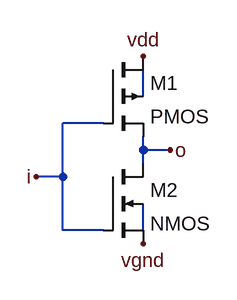
[diagram p0: schematic CMOS_Inverter.asc]
CMOS_Inverter.asc, the LTspice schematic file:
Version 4.1
SHEET 1 880 680
WIRE 256 112 256 80
WIRE 208 144 160 144
WIRE 256 176 256 160
WIRE 288 176 256 176
WIRE 256 192 256 176
WIRE 160 208 160 144
WIRE 160 208 128 208
WIRE 160 272 160 208
WIRE 208 272 160 272
WIRE 256 272 256 240
FLAG 256 64 vdd
FLAG 128 208 i
FLAG 288 176 o
FLAG 256 288 vgnd
SYMBOL pmos4 208 64 R0
SYMATTR InstName M1
SYMBOL nmos4 208 192 R0
SYMATTR InstName M2

The netlist it stands for:
* CMOS_Inverter.asc
M1 vdd i o N001 PMOS
M2 o i vgnd N002 NMOS
.model NMOS NMOS
.model PMOS PMOS
.lib standard.mos
.backanno
.end